# EAGLE design mainboard (EAGLE 6.3)
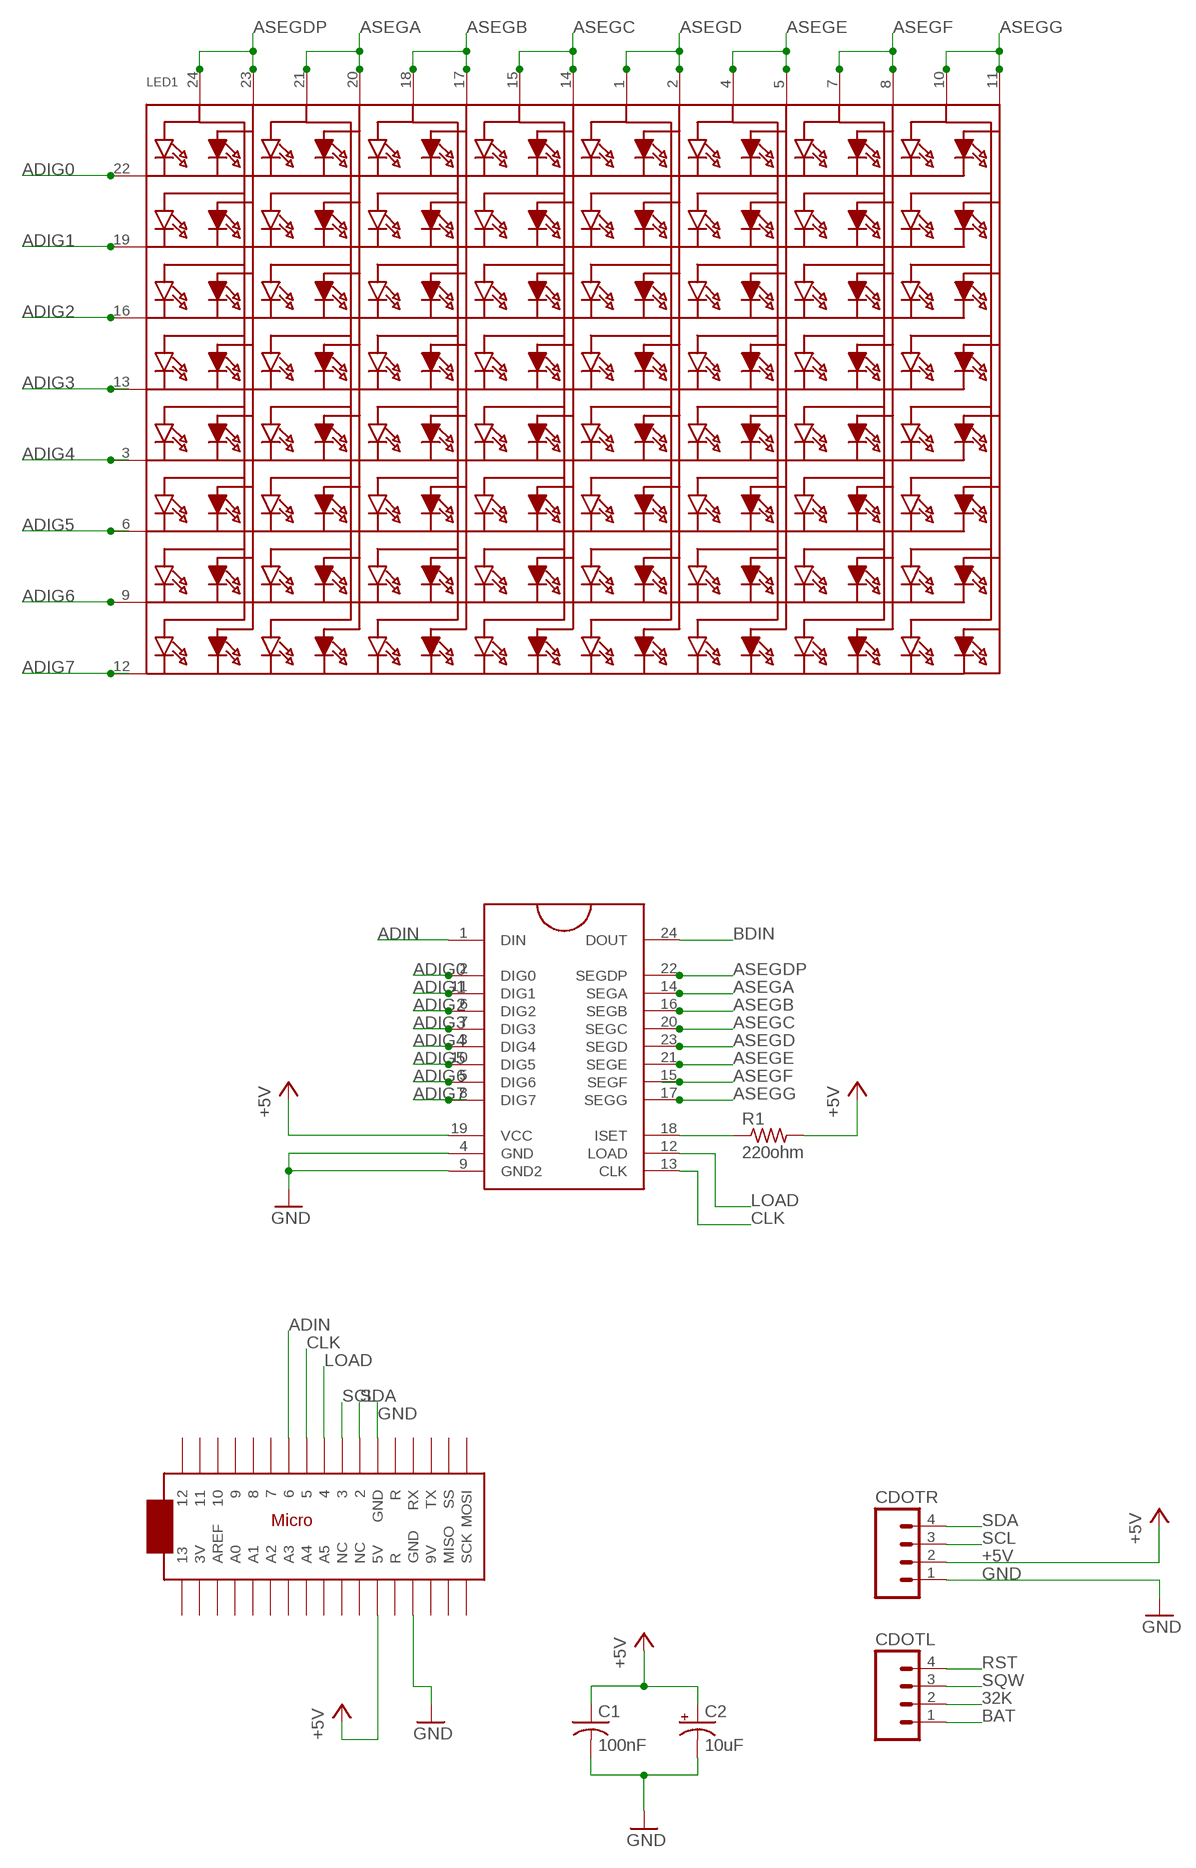
[diagram p0: schematic, sheet 1, part 1 of 2]
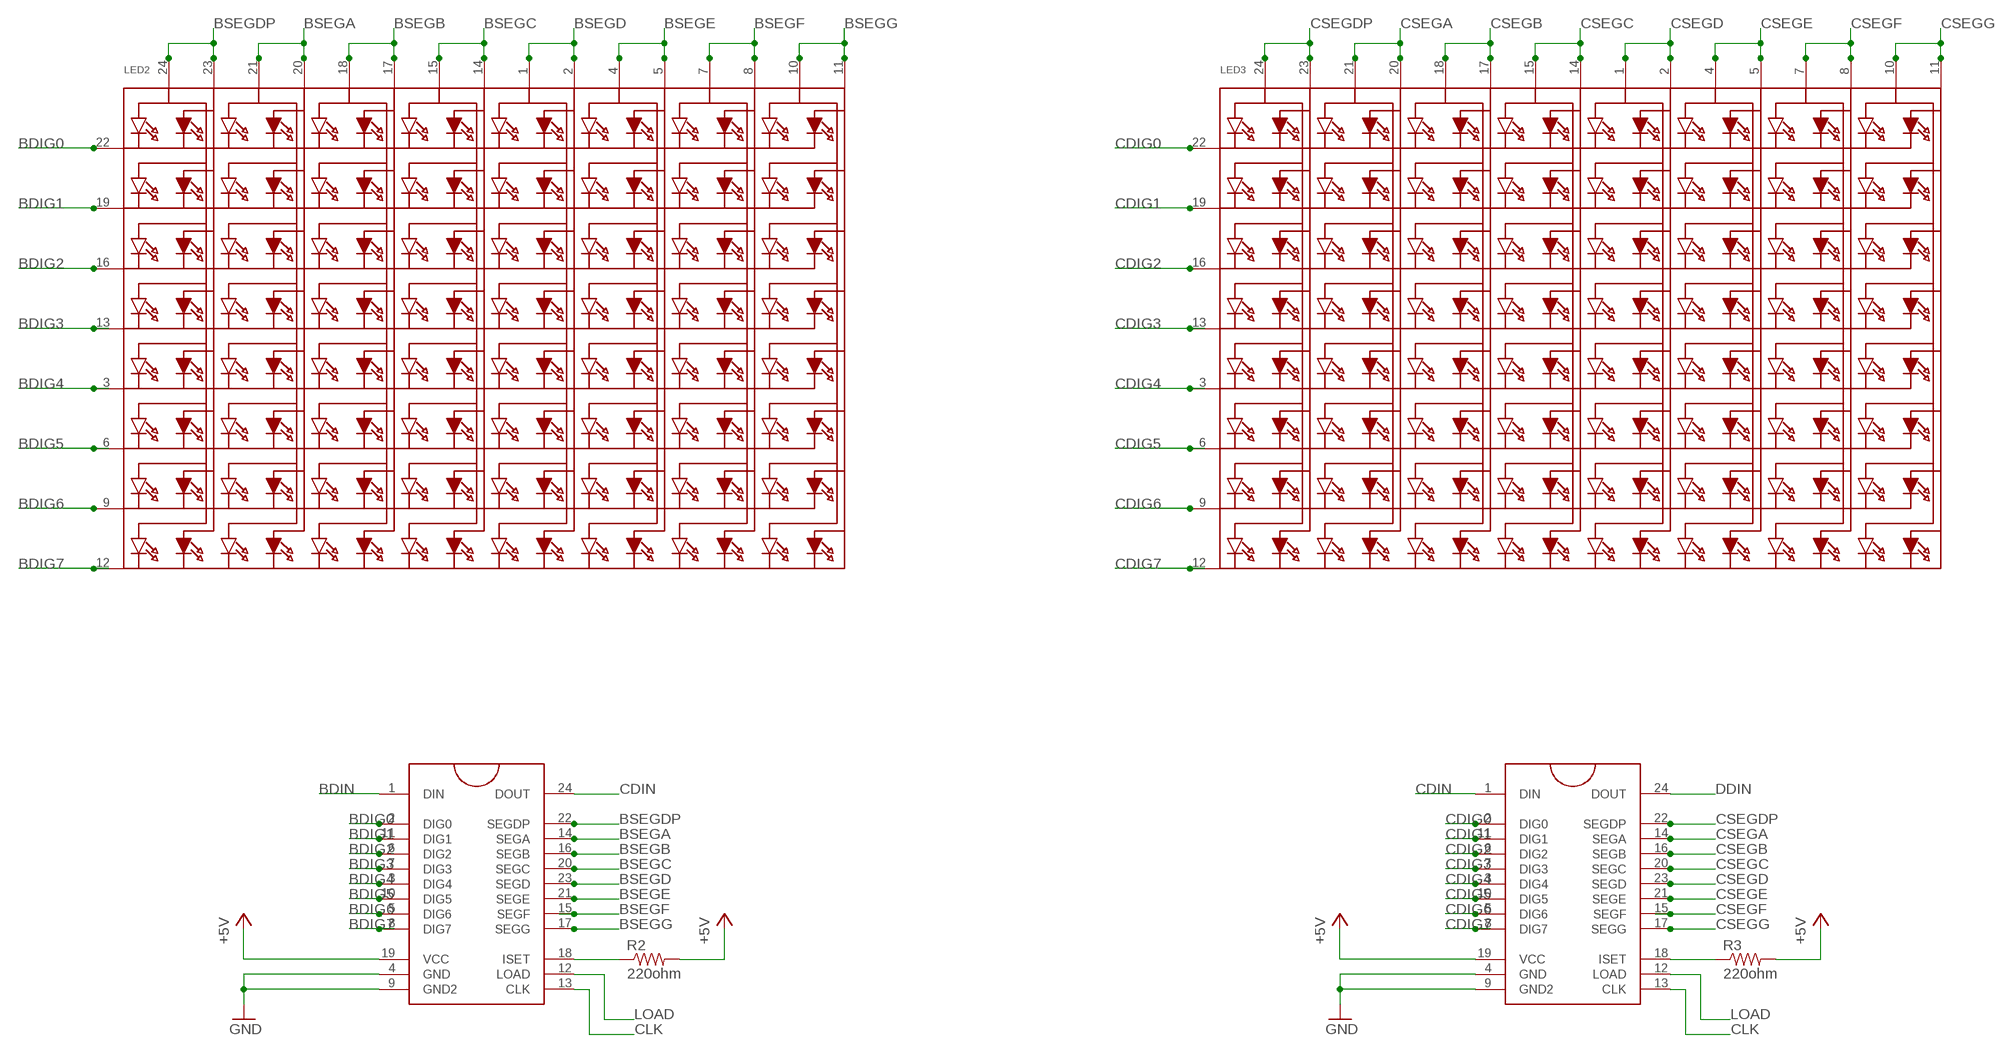
[diagram p1: schematic, sheet 1, part 2 of 2]

## Parts
ARDUINO  ARDUINOMICRO  [ARDUINOMICRO]
C1  100nF  C-US050-030X075  [C050-030X075]
C2  10uF  CPOL-USE2.5-6  [E2,5-6]
CDOTL  M04PTH  [1X04]
CDOTR  M04PTH  [1X04]
LED1  SEGMENT_8X8_BICOLOR_ROWCATHODEMI2A883XX  [SEGMENT_BICOL_BL-M12A883XX]
LED2  SEGMENT_8X8_BICOLOR_ROWCATHODEMI2A883XX  [SEGMENT_BICOL_BL-M12A883XX]
LED3  SEGMENT_8X8_BICOLOR_ROWCATHODEMI2A883XX  [SEGMENT_BICOL_BL-M12A883XX]
MAX1  MAX7219DIP  [DIL24]
MAX2  MAX7219DIP  [DIL24]
MAX3  MAX7219DIP  [DIL24]
R1  220ohm  R-US_0207/10  [0207/10]
R2  220ohm  R-US_0207/10  [0207/10]
R3  220ohm  R-US_0207/10  [0207/10]

## Nets
32K: CDOTL.2
+5V: ARDUINO.P$23(5V) C1.1 C2.+ CDOTR.2 MAX1.19(VCC) MAX2.19(VCC) MAX3.19(VCC) R1.2 R2.2 R3.2
ADIG0: LED1.22(K1) MAX1.2(DIG0)
ADIG1: LED1.19(K2) MAX1.11(DIG1)
ADIG2: LED1.16(K3) MAX1.6(DIG2)
ADIG3: LED1.13(K4) MAX1.7(DIG3)
ADIG4: LED1.3(K5) MAX1.3(DIG4)
ADIG5: LED1.6(K6) MAX1.10(DIG5)
ADIG6: LED1.9(K7) MAX1.5(DIG6)
ADIG7: LED1.12(K8) MAX1.8(DIG7)
ADIN: ARDUINO.P$7 MAX1.1(DIN)
ASEGA: LED1.20(A4) LED1.21(A3) MAX1.14(SEGA)
ASEGB: LED1.17(A6) LED1.18(A5) MAX1.16(SEGB)
ASEGC: LED1.14(A8) LED1.15(A7) MAX1.20(SEGC)
ASEGD: LED1.1(A9) LED1.2(A10) MAX1.23(SEGD)
ASEGDP: LED1.23(A2) LED1.24(A1) MAX1.22(SEGDP)
ASEGE: LED1.4(A11) LED1.5(A12) MAX1.21(SEGE)
ASEGF: LED1.7(A13) LED1.8(A14) MAX1.15(SEGF)
ASEGG: LED1.10(A15) LED1.11(A16) MAX1.17(SEGG)
BAT: CDOTL.1
BDIG0: LED2.22(K1) MAX2.2(DIG0)
BDIG1: LED2.19(K2) MAX2.11(DIG1)
BDIG2: LED2.16(K3) MAX2.6(DIG2)
BDIG3: LED2.13(K4) MAX2.7(DIG3)
BDIG4: LED2.3(K5) MAX2.3(DIG4)
BDIG5: LED2.6(K6) MAX2.10(DIG5)
BDIG6: LED2.9(K7) MAX2.5(DIG6)
BDIG7: LED2.12(K8) MAX2.8(DIG7)
BDIN: MAX1.24(DOUT) MAX2.1(DIN)
BSEGA: LED2.20(A4) LED2.21(A3) MAX2.14(SEGA)
BSEGB: LED2.17(A6) LED2.18(A5) MAX2.16(SEGB)
BSEGC: LED2.14(A8) LED2.15(A7) MAX2.20(SEGC)
BSEGD: LED2.1(A9) LED2.2(A10) MAX2.23(SEGD)
BSEGDP: LED2.23(A2) LED2.24(A1) MAX2.22(SEGDP)
BSEGE: LED2.4(A11) LED2.5(A12) MAX2.21(SEGE)
BSEGF: LED2.7(A13) LED2.8(A14) MAX2.15(SEGF)
BSEGG: LED2.10(A15) LED2.11(A16) MAX2.17(SEGG)
CDIG0: LED3.22(K1) MAX3.2(DIG0)
CDIG1: LED3.19(K2) MAX3.11(DIG1)
CDIG2: LED3.16(K3) MAX3.6(DIG2)
CDIG3: LED3.13(K4) MAX3.7(DIG3)
CDIG4: LED3.3(K5) MAX3.3(DIG4)
CDIG5: LED3.6(K6) MAX3.10(DIG5)
CDIG6: LED3.9(K7) MAX3.5(DIG6)
CDIG7: LED3.12(K8) MAX3.8(DIG7)
CDIN: MAX2.24(DOUT) MAX3.1(DIN)
CLK: ARDUINO.P$8 MAX1.13(CLK) MAX2.13(CLK) MAX3.13(CLK)
CSEGA: LED3.20(A4) LED3.21(A3) MAX3.14(SEGA)
CSEGB: LED3.17(A6) LED3.18(A5) MAX3.16(SEGB)
CSEGC: LED3.14(A8) LED3.15(A7) MAX3.20(SEGC)
CSEGD: LED3.1(A9) LED3.2(A10) MAX3.23(SEGD)
CSEGDP: LED3.23(A2) LED3.24(A1) MAX3.22(SEGDP)
CSEGE: LED3.4(A11) LED3.5(A12) MAX3.21(SEGE)
CSEGF: LED3.7(A13) LED3.8(A14) MAX3.15(SEGF)
CSEGG: LED3.10(A15) LED3.11(A16) MAX3.17(SEGG)
DDIN: MAX3.24(DOUT)
GND: ARDUINO.P$12(GND) ARDUINO.P$21(GND) C1.2 C2.- CDOTR.1 MAX1.4(GND) MAX1.9(GND2) MAX2.4(GND) MAX2.9(GND2) MAX3.4(GND) MAX3.9(GND2)
LOAD: ARDUINO.P$9 MAX1.12(LOAD) MAX2.12(LOAD) MAX3.12(LOAD)
N$1: MAX1.18(ISET) R1.1
N$2: MAX2.18(ISET) R2.1
N$3: MAX3.18(ISET) R3.1
RST: CDOTL.4
SCL: ARDUINO.P$10 CDOTR.3
SDA: ARDUINO.P$11 CDOTR.4
SQW: CDOTL.3
Unconnected: ARDUINO.P$1 ARDUINO.P$2 ARDUINO.P$3 ARDUINO.P$4 ARDUINO.P$5 ARDUINO.P$6 ARDUINO.P$13(R) ARDUINO.P$14(RX) ARDUINO.P$15(TX) ARDUINO.P$16(SS) ARDUINO.P$17(MOSI) ARDUINO.P$18(SCK) ARDUINO.P$19(MISO) ARDUINO.P$20(9V) ARDUINO.P$22(R) ARDUINO.P$24(NC) ARDUINO.P$25(NC) ARDUINO.P$26(A5) ARDUINO.P$27(A4) ARDUINO.P$28(A3) ARDUINO.P$29(A2) ARDUINO.P$30(A1) ARDUINO.P$31(A0) ARDUINO.P$32(AREF) ARDUINO.P$33(3V) ARDUINO.P$34

## Library data of the parts
ARDUINO = adafruit:ARDUINOMICRO
C1 = adafruit:C-US: CAPACITOR, American symbol
C2 = rcl:CPOL-US: POLARIZED CAPACITOR, American symbol
CDOTL CDOTR = SparkFun-Connectors:M04: Header 4 Standard 4-pin 0.1" header. Use with straight break away headers (SKU : PRT-00116), right angle break away headers (PRT-00553), swiss pins (PRT-00743), machine pins (PRT-00117), and female headers (PRT-00115). Molex polarized connector foot print use with SKU : PRT-08231 with associated crimp pins and housings. 1MM SMD Version SKU: PRT-10208
LED1-LED3 = adafruit:SEGMENT_8X8_BICOLOR_ROWCATHODE: 8x8 Bi-Color LED Segment Displays: Row = Cathode 1.2" Bi-Color 8x8 Matrix, 3.0mm Square LEDs - BL-M12A883XX
MAX1-MAX3 = SparkFun-DigitalIC:MAX7219: 8-digit, 8-segment LED display driver, serial input
R1-R3 = rcl:R-US_: RESISTOR, American symbol

## Board
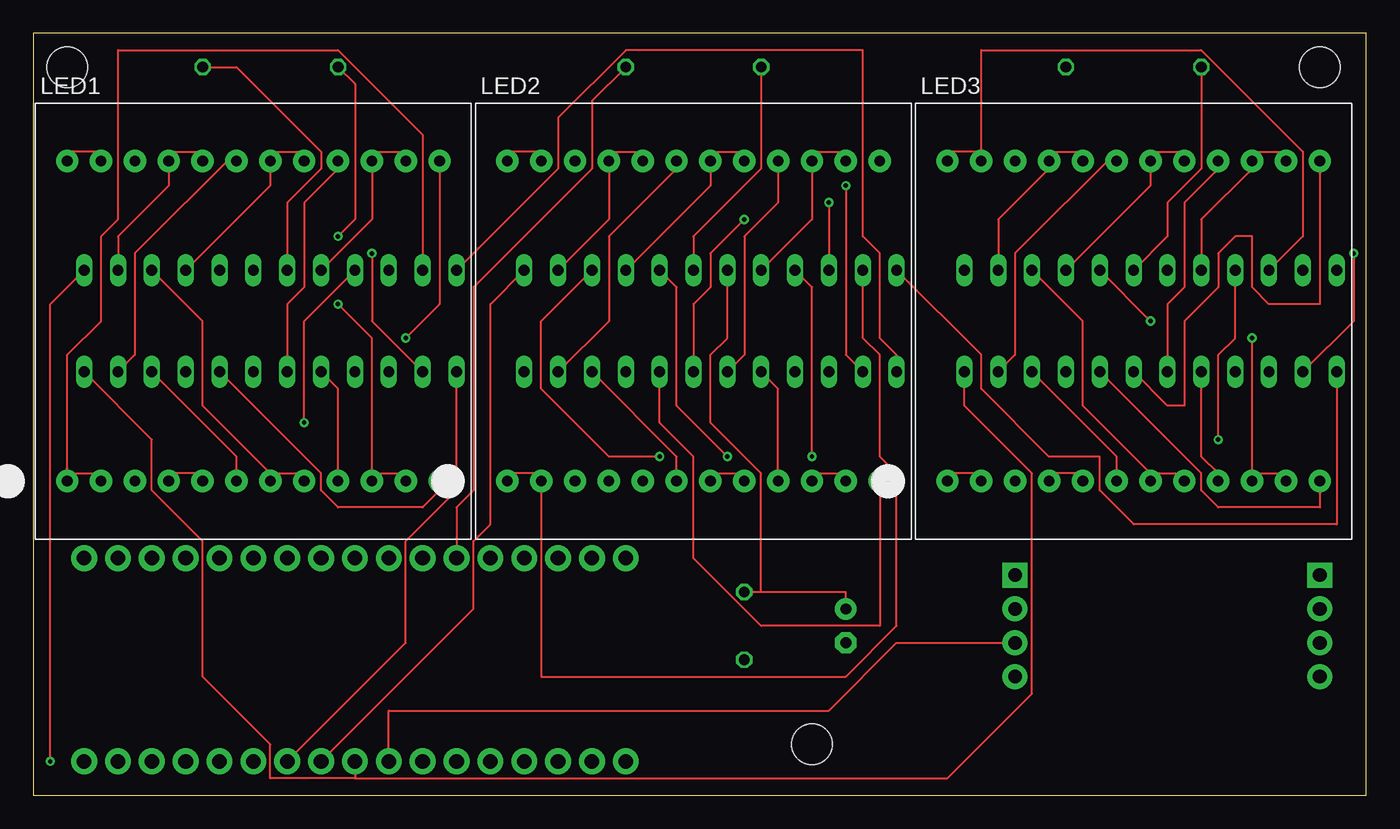
[diagram p2: board, top side]
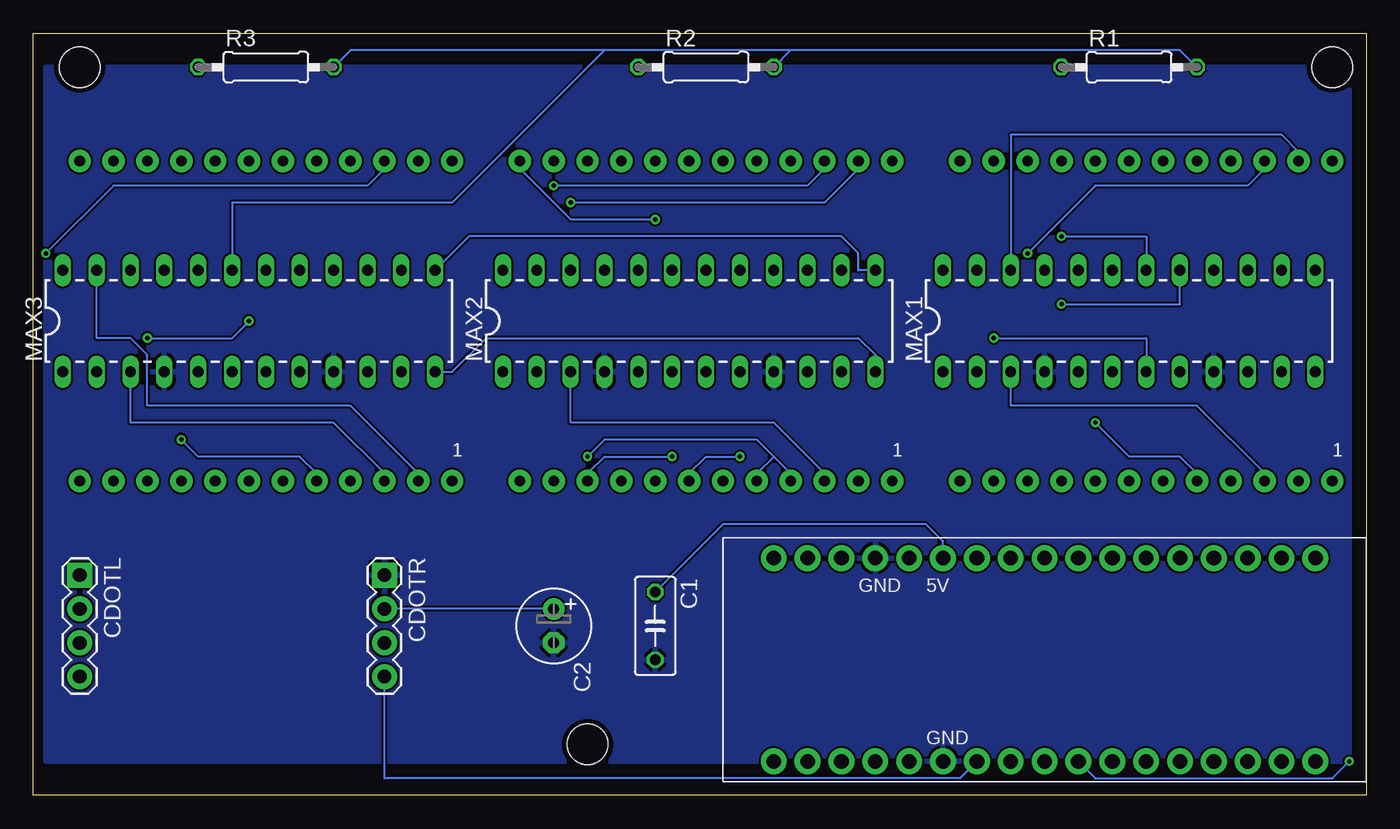
[diagram p3: board, bottom side, seen from below]

Size 100 x 57.14 mm. Coordinates in mm from the lower left corner, seen from the top.
Outline: 0,0 100,0 100,57.14 0,57.14 0,0
Copper layers (1*16): Top 0.0356mm / dielectric 1.5011mm / Bottom 0.0356mm
Design rules "LaenPCBOrder": minimum track width 6mil, minimum drill 13mil, track to track 6mil, track to pad 6mil, pad to pad 6mil, via to via 6mil, smd to smd 6mil, copper to edge 15mil, drill to drill 6mil, minimum pad ring 7mil, minimum via ring 7mil, stop-mask expansion 3mil, vias tented up to drill 0mil, thermal gap 10mil
Holes 3.05 mm at 58.42,3.81 2.54,54.61 96.52,54.61

### Footprints (pad centres in the part's own frame; a part is rotated, then mirrored left to right if it is on the bottom)
ARDUINOMICRO = drill 1.1 pad 1.93: P$1 -20.32,7.62; P$2 -17.78,7.62; P$3 -15.24,7.62; P$4 -12.7,7.62; P$5 -10.16,7.62; P$6 -7.62,7.62; P$7 -5.08,7.62; P$8 -2.54,7.62; P$9 0,7.62; P$10 2.54,7.62; P$11 5.08,7.62; P$12 12.7,-7.62; P$13 10.16,-7.62; P$14 12.7,7.62; P$15 15.24,7.62; P$16 17.78,7.62; P$17 20.32,7.62; P$18 20.32,-7.62; P$19 17.78,-7.62; P$20 15.24,-7.62; P$21 7.62,7.62; P$22 10.16,7.62; P$23 7.62,-7.62; P$24 5.08,-7.62; P$25 2.54,-7.62; P$26 0,-7.62; P$27 -2.54,-7.62; P$28 -5.08,-7.62; P$29 -7.62,-7.62; P$30 -10.16,-7.62; P$31 -12.7,-7.62; P$32 -15.24,-7.62; P$33 -17.78,-7.62; P$34 -20.32,-7.62
C050-030X075 = drill 0.813 octagon: 1 -2.54,0; 2 2.54,0
E2,5-6 = drill 0.813 pad 1.6: + -1.27,0 | drill 0.813 pad 1.6 octagon: - 1.27,0
1X04 = drill 1.016 pad 1.88 square: 1 0,0 | drill 1.016 pad 1.88: 2 2.54,0; 3 5.08,0; 4 7.62,0
SEGMENT_BICOL_BL-M12A883XX = drill 0.8 pad 1.676: 1 -13.97,-12; 2 -11.43,-12; 3 -8.89,-12; 4 -6.35,-12; 5 -3.81,-12; 6 -1.27,-12; 7 1.27,-12; 8 3.81,-12; 9 6.35,-12; 10 8.89,-12; 11 11.43,-12; 12 13.97,-12; 13 13.97,12; 14 11.43,12; 15 8.89,12; 16 6.35,12; 17 3.81,12; 18 1.27,12; 19 -1.27,12; 20 -3.81,12; 21 -6.35,12; 22 -8.89,12; 23 -11.43,12; 24 -13.97,12
DIL24 = drill 0.813 long: 1 -13.97,-3.81; 2 -11.43,-3.81; 3 -8.89,-3.81; 4 -6.35,-3.81; 5 -3.81,-3.81; 6 -1.27,-3.81; 7 1.27,-3.81; 8 3.81,-3.81; 9 6.35,-3.81; 10 8.89,-3.81; 11 11.43,-3.81; 12 13.97,-3.81; 13 13.97,3.81; 14 11.43,3.81; 15 8.89,3.81; 16 6.35,3.81; 17 3.81,3.81; 18 1.27,3.81; 19 -1.27,3.81; 20 -3.81,3.81; 21 -6.35,3.81; 22 -8.89,3.81; 23 -11.43,3.81; 24 -13.97,3.81
0207/10 = drill 0.813 octagon: 1 -5.08,0; 2 5.08,0

### Placement (x,y rotation side)
ARDUINO  24.13,10.16 180 bottom
C1  53.34,12.7 270 bottom
C2  60.96,12.7 270 bottom
CDOTL  96.52,16.51 270 bottom
CDOTR  73.66,16.51 270 bottom
LED1  16.51,35.56 0 top
LED2  49.53,35.56 0 top
LED3  82.55,35.56 0 top
MAX1  17.78,35.56 0 bottom
MAX2  50.8,35.56 0 bottom
MAX3  83.82,35.56 0 bottom
R1  17.78,54.61 0 bottom
R2  49.53,54.61 0 bottom
R3  82.55,54.61 0 bottom

### Tracks (layer width: path | path; a pad name or v marks a point on that pad's centre or on a via)
+5V
  Top 0.152: 54.61,15.24 60.96,15.24 C2.+ | 54.61,15.24 C1.1 | MAX2.19 52.07,34.29 50.8,33.02 50.8,27.94 54.61,24.13 54.61,15.24 | MAX1.19 19.05,44.45 21.59,46.99 21.59,48.26 15.24,54.61 R1.2 | ARDUINO.P$23 31.75,21.59 33.02,22.86 33.02,38.1 41.91,46.99 41.91,52.07 R2.2
  Bottom 0.152: C2.+ CDOTR.2 | 43.18,55.88 R2.2 | 43.18,55.88 13.97,55.88 R1.2 | R3.2 76.2,55.88 57.15,55.88 | 43.18,55.88 57.15,55.88 | MAX3.19 85.09,44.45 68.58,44.45 57.15,55.88 | C1.1 48.26,20.32 33.02,20.32 31.75,19.05 ARDUINO.P$23
ADIG0  (via drill 0.33)
  Top 0.152: MAX1.2 25.4,35.56 v25.4,40.64
  Bottom 0.152: v25.4,40.64 20.32,45.72 8.89,45.72 7.62,46.99 LED1.22
ADIG1
  Top 0.152: MAX1.11 7.62,33.02 7.62,40.64 15.24,48.26 LED1.19
ADIG2
  Top 0.152: MAX1.6 19.05,36.83 20.32,38.1 20.32,44.45 22.86,46.99 LED1.16
ADIG3  (via drill 0.33)
  Top 0.152: v27.94,34.29 30.48,36.83 LED1.13
  Bottom 0.152: MAX1.7 16.51,34.29 v27.94,34.29
ADIG4
  Bottom 0.152: MAX1.3 26.67,29.21 12.7,29.21 7.62,24.13 LED1.3
ADIG5
  Top 0.152: MAX1.10 15.24,25.4 LED1.6
ADIG6
  Top 0.152: MAX1.5 22.86,30.48 LED1.9
ADIG7
  Top 0.152: MAX1.8 21.59,24.13 21.59,22.86 22.86,21.59 29.21,21.59 30.48,22.86 LED1.12
ADIN
  Top 0.152: MAX1.1 31.75,22.86 27.94,19.05 27.94,11.43 ARDUINO.P$7
ASEGA
  Top 0.152: MAX1.14 6.35,41.91 10.16,45.72 LED1.21 10.16,48.26 12.7,48.26 LED1.20
ASEGB
  Top 0.152: MAX1.16 17.78,45.72 LED1.18 17.78,48.26 20.32,48.26 LED1.17
ASEGC
  Top 0.152: MAX1.20 25.4,43.18 LED1.15 25.4,48.26 27.94,48.26 LED1.14
ASEGD
  Top 0.152: MAX1.23 29.21,49.53 22.86,55.88 6.35,55.88 6.35,43.18 5.08,41.91 5.08,35.56 2.54,33.02 2.54,24.13 | 2.54,24.13 5.08,24.13 LED1.2 | 2.54,24.13 LED1.1
ASEGDP
  Top 0.152: LED1.24 2.54,48.26 5.08,48.26 LED1.23
  Bottom 0.152: MAX1.22 26.67,49.53 6.35,49.53 5.08,48.26 LED1.23
ASEGE  (via drill 0.33)
  Top 0.152: MAX1.21 20.32,35.56 v20.32,27.94 | LED1.4 10.16,24.13 12.7,24.13 LED1.5
  Bottom 0.152: v20.32,27.94 17.78,25.4 13.97,25.4 12.7,24.13 LED1.5
ASEGF
  Top 0.152: MAX1.15 12.7,35.56 12.7,29.21 17.78,24.13 | 17.78,24.13 20.32,24.13 LED1.8 | 17.78,24.13 LED1.7
ASEGG  (via drill 0.33)
  Top 0.152: v22.86,36.83 25.4,34.29 25.4,24.13 | 25.4,24.13 27.94,24.13 LED1.11 | 25.4,24.13 LED1.10
  Bottom 0.152: MAX1.17 13.97,36.83 v22.86,36.83
BDIG0  (via drill 0.33)
  Top 0.152: MAX2.2 60.96,33.02 v60.96,45.72
  Bottom 0.152: v60.96,45.72 41.91,45.72 40.64,46.99 LED2.22
BDIG1
  Top 0.152: MAX2.11 43.18,35.56 43.18,41.91 48.26,46.99 LED2.19
BDIG2
  Top 0.152: MAX2.6 53.34,33.02 53.34,41.91 55.88,44.45 LED2.16
BDIG3  (via drill 0.33)
  Top 0.152: MAX2.7 49.53,36.83 50.8,38.1 50.8,40.64 v53.34,43.18
  Bottom 0.152: v53.34,43.18 59.69,43.18 63.5,46.99 LED2.13
BDIG4
  Bottom 0.152: MAX2.3 59.69,27.94 44.45,27.94 40.64,24.13 LED2.3
BDIG5
  Top 0.152: MAX2.10 48.26,25.4 LED2.6
BDIG6
  Top 0.152: MAX2.5 55.88,30.48 LED2.9
BDIG7
  Top 0.152: MAX2.8 46.99,27.94 49.53,25.4 49.53,17.78 54.61,12.7 63.5,12.7 LED2.12
BDIN
  Top 0.152: MAX1.24 39.37,46.99 39.37,50.8 44.45,55.88 62.23,55.88 62.23,41.91 63.5,40.64 63.5,34.29 64.77,33.02 MAX2.1
BSEGA
  Top 0.152: MAX2.14 43.18,43.18 LED2.21 43.18,48.26 45.72,48.26 LED2.20
BSEGB
  Top 0.152: MAX2.16 50.8,45.72 LED2.18 50.8,48.26 53.34,48.26 LED2.17
BSEGC
  Top 0.152: MAX2.20 58.42,43.18 LED2.15 58.42,48.26 60.96,48.26 LED2.14
BSEGD
  Top 0.152: MAX2.23 62.23,34.29 63.5,33.02 63.5,25.4 64.77,24.13 64.77,12.7 60.96,8.89 38.1,8.89 LED2.2 38.1,24.13 35.56,24.13 LED2.1
BSEGDP  (via drill 0.33)
  Top 0.152: v59.69,44.45 MAX2.22 | LED2.24 35.56,48.26 38.1,48.26 LED2.23
  Bottom 0.152: v59.69,44.45 40.64,44.45 38.1,46.99 LED2.23
BSEGE  (via drill 0.33)
  Top 0.152: MAX2.21 58.42,38.1 v58.42,25.4
  Bottom 0.152: v58.42,25.4 57.15,26.67 45.72,26.67 44.45,25.4 | 44.45,25.4 43.18,24.13 LED2.4 | 44.45,25.4 45.72,24.13 LED2.5
BSEGF  (via drill 0.33)
  Top 0.152: MAX2.15 38.1,35.56 38.1,30.48 43.18,25.4 v46.99,25.4 | LED2.8 53.34,24.13 50.8,24.13 LED2.7
  Bottom 0.152: v46.99,25.4 49.53,25.4 50.8,24.13 LED2.7
BSEGG  (via drill 0.33)
  Top 0.152: MAX2.17 48.26,38.1 48.26,29.21 v52.07,25.4 | LED2.11 60.96,24.13 58.42,24.13 LED2.10
  Bottom 0.152: v52.07,25.4 57.15,25.4 58.42,24.13 LED2.10
CDIG0  (via drill 0.33)
  Top 0.152: MAX3.2 99.06,35.56 v99.06,40.64
  Bottom 0.152: v99.06,40.64 93.98,45.72 74.93,45.72 73.66,46.99 LED3.22
CDIG1
  Top 0.152: MAX3.11 73.66,33.02 73.66,40.64 81.28,48.26 LED3.19
CDIG2
  Top 0.152: MAX3.6 85.09,36.83 86.36,38.1 86.36,44.45 88.9,46.99 LED3.16
CDIG3
  Top 0.152: MAX3.7 85.09,29.21 86.36,29.21 86.36,35.56 88.9,38.1 88.9,40.64 90.17,41.91 91.44,41.91 91.44,38.1 92.71,36.83 96.52,36.83 LED3.13
CDIG4
  Bottom 0.152: MAX3.3 92.71,27.94 77.47,27.94 73.66,24.13 LED3.3
CDIG5
  Top 0.152: MAX3.10 81.28,25.4 LED3.6
CDIG6
  Top 0.152: MAX3.5 87.63,25.4 88.9,24.13 LED3.9
CDIG7
  Top 0.152: MAX3.8 87.63,24.13 87.63,22.86 88.9,21.59 96.52,21.59 LED3.12
CDIN
  Top 0.152: MAX2.24 71.12,33.02 71.12,30.48 76.2,25.4 80.01,25.4 80.01,22.86 82.55,20.32 97.79,20.32 MAX3.1
CLK  (via drill 0.33)
  Top 0.152: MAX1.13 1.27,36.83 v1.27,2.54 | MAX2.13 34.29,36.83 34.29,20.32 33.02,19.05 33.02,13.97 ARDUINO.P$8
  Bottom 0.152: v1.27,2.54 2.54,1.27 20.32,1.27 ARDUINO.P$8 | MAX3.13 67.31,41.91 39.37,41.91 38.1,40.64 38.1,39.37 MAX2.13
CSEGA
  Top 0.152: MAX3.14 72.39,43.18 76.2,46.99 LED3.21 76.2,48.26 78.74,48.26 LED3.20
CSEGB
  Top 0.152: MAX3.16 83.82,45.72 LED3.18 83.82,48.26 86.36,48.26 LED3.17
CSEGC
  Top 0.152: MAX3.20 87.63,43.18 91.44,46.99 LED3.15 91.44,48.26 93.98,48.26 LED3.14
CSEGD
  Top 0.152: LED3.1 68.58,24.13 71.12,24.13 LED3.2
  Bottom 0.152: MAX3.23 95.25,34.29 92.71,34.29 91.44,33.02 91.44,29.21 76.2,29.21 71.12,24.13 LED3.2
CSEGDP
  Top 0.152: MAX3.22 95.25,41.91 95.25,48.26 87.63,55.88 71.12,55.88 71.12,48.26 | 71.12,48.26 68.58,48.26 LED3.24 | 71.12,48.26 LED3.23
CSEGE  (via drill 0.33)
  Top 0.152: MAX3.21 90.17,34.29 88.9,33.02 v88.9,26.67 | LED3.4 76.2,24.13 78.74,24.13 LED3.5
  Bottom 0.152: v88.9,26.67 87.63,25.4 80.01,25.4 78.74,24.13 LED3.5
CSEGF
  Top 0.152: MAX3.15 78.74,35.56 78.74,29.21 83.82,24.13 | 83.82,24.13 86.36,24.13 LED3.8 | 83.82,24.13 LED3.7
CSEGG  (via drill 0.33)
  Top 0.152: v83.82,35.56 MAX3.17 | 91.44,24.13 v91.44,34.29 | 91.44,24.13 93.98,24.13 LED3.11 | 91.44,24.13 LED3.10
  Bottom 0.152: v83.82,35.56 85.09,34.29 v91.44,34.29
GND
  pour Bottom: 1.27,54.61 99.06,54.61 99.06,2.54 1.27,2.54
LOAD
  Top 0.152: MAX1.12 8.89,26.67 8.89,22.86 12.7,19.05 12.7,8.89 17.78,3.81 17.78,1.27 24.13,1.27 | ARDUINO.P$9 24.13,1.27 | MAX3.12 69.85,29.21 74.93,24.13 74.93,7.62 68.58,1.27 24.13,1.27
  Bottom 0.152: MAX2.12 36.83,33.02 38.1,34.29 66.04,34.29 68.58,31.75 MAX3.12
N$1  (via drill 0.33)
  Top 0.152: v22.86,41.91 24.13,43.18 24.13,53.34 R1.1
  Bottom 0.152: MAX1.18 16.51,41.91 v22.86,41.91
N$2
  Top 0.152: MAX2.18 49.53,41.91 54.61,46.99 R2.1
N$3
  Top 0.152: MAX3.18 85.09,41.91 85.09,44.45 87.63,46.99 R3.1
SCL
  Top 0.152: CDOTR.3 64.77,11.43 59.69,6.35 26.67,6.35 ARDUINO.P$10
SDA
  Bottom 0.152: CDOTR.4 73.66,1.27 30.48,1.27 ARDUINO.P$11

### Text on the board
bNames: 1 | 1 | 1 | 5V | GND | GND